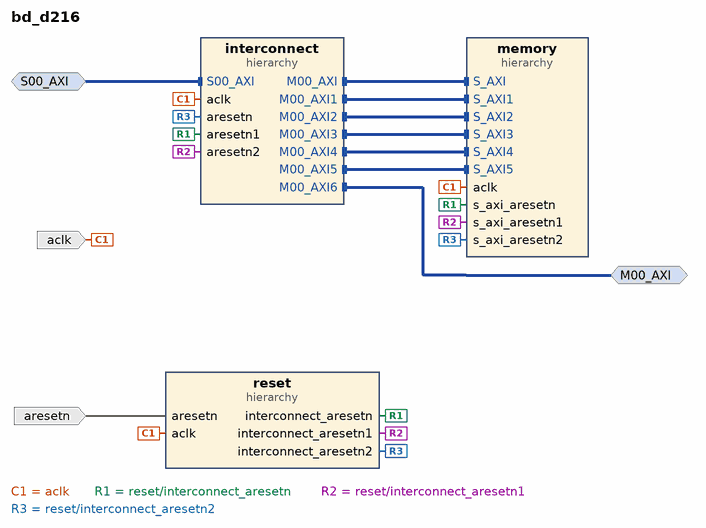
[diagram p0: block diagram of the top level]
# Vivado block design bd_d216, xcu55c-fsvh2892-2L-e, Vivado 2022.1
create_bd_design bd_d216

create_bd_intf_port -mode Slave -vlnv xilinx.com:interface:aximm_rtl:1.0 S00_AXI
set_property -dict [list \
  CONFIG.ADDR_WIDTH 38 \
  CONFIG.NUM_READ_OUTSTANDING 2 \
  CONFIG.NUM_WRITE_OUTSTANDING 2 \
  CONFIG.master_id 1 \
] [get_bd_intf_ports S00_AXI]
create_bd_intf_port -mode Master -vlnv xilinx.com:interface:aximm_rtl:1.0 M00_AXI
set_property -dict {CONFIG.ADDR_WIDTH 38} [get_bd_intf_ports M00_AXI]
create_bd_port -dir I -type clk aclk
set_property -dict {CONFIG.ASSOCIATED_BUSIF M00_AXI:S00_AXI} [get_bd_ports aclk]
create_bd_port -dir I -type rst aresetn

create_bd_cell -type hier reset
create_bd_cell -type hier interconnect
create_bd_cell -type hier memory

# ---- hierarchy /reset ----
current_bd_instance /reset
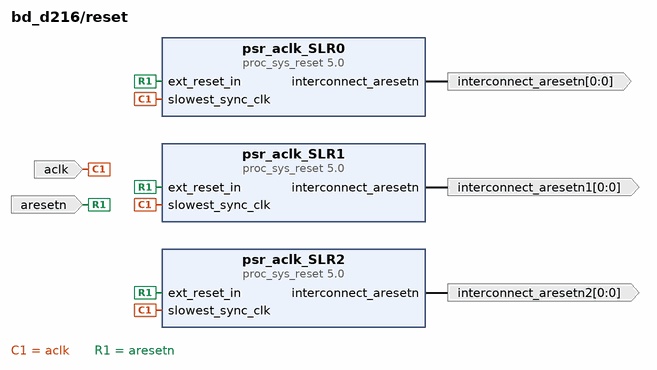
[diagram p1: block diagram inside /reset]
create_bd_pin -dir I -type clk aclk
create_bd_pin -dir I -type rst aresetn
create_bd_pin -dir O -from 0 -to 0 -type rst interconnect_aresetn
create_bd_pin -dir O -from 0 -to 0 -type rst interconnect_aresetn1
create_bd_pin -dir O -from 0 -to 0 -type rst interconnect_aresetn2

create_bd_cell -type ip -vlnv xilinx.com:ip:proc_sys_reset:5.0 psr_aclk_SLR0
set_property -dict {CONFIG.SLR_ASSIGNMENTS SLR0} [get_bd_cells psr_aclk_SLR0]
create_bd_cell -type ip -vlnv xilinx.com:ip:proc_sys_reset:5.0 psr_aclk_SLR1
set_property -dict {CONFIG.SLR_ASSIGNMENTS SLR1} [get_bd_cells psr_aclk_SLR1]
create_bd_cell -type ip -vlnv xilinx.com:ip:proc_sys_reset:5.0 psr_aclk_SLR2
set_property -dict {CONFIG.SLR_ASSIGNMENTS SLR2} [get_bd_cells psr_aclk_SLR2]

# ---- hierarchy /interconnect ----
current_bd_instance /interconnect
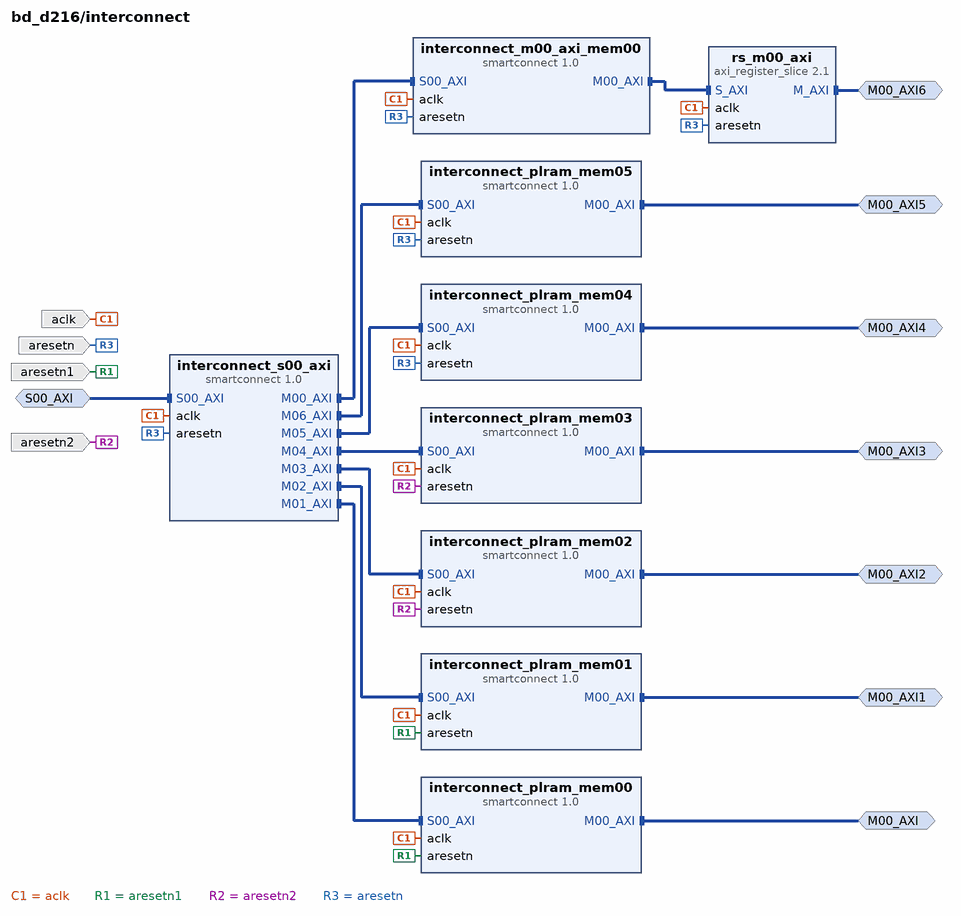
[diagram p2: block diagram inside /interconnect]
create_bd_intf_pin -mode Slave -vlnv xilinx.com:interface:aximm_rtl:1.0 S00_AXI
create_bd_intf_pin -mode Master -vlnv xilinx.com:interface:aximm_rtl:1.0 M00_AXI
create_bd_intf_pin -mode Master -vlnv xilinx.com:interface:aximm_rtl:1.0 M00_AXI1
create_bd_intf_pin -mode Master -vlnv xilinx.com:interface:aximm_rtl:1.0 M00_AXI2
create_bd_intf_pin -mode Master -vlnv xilinx.com:interface:aximm_rtl:1.0 M00_AXI3
create_bd_intf_pin -mode Master -vlnv xilinx.com:interface:aximm_rtl:1.0 M00_AXI4
create_bd_intf_pin -mode Master -vlnv xilinx.com:interface:aximm_rtl:1.0 M00_AXI5
create_bd_intf_pin -mode Master -vlnv xilinx.com:interface:aximm_rtl:1.0 M00_AXI6
create_bd_pin -dir I -type clk aclk
create_bd_pin -dir I -type rst aresetn
create_bd_pin -dir I -type rst aresetn1
create_bd_pin -dir I -type rst aresetn2

create_bd_cell -type ip -vlnv xilinx.com:ip:smartconnect:1.0 interconnect_s00_axi
set_property -dict [list \
  CONFIG.ADVANCED_PROPERTIES {__view__ {functional {S00_Buffer {R_SIZE 512 W_SIZE 512} S00_Entry {PKT_R_THR 512 LIM_R_LEN 256 PKT_W_THR 64 LIM_W_LEN 256}} timing {M01_Buffer {AR_SLR_PIPE 3 AW_SLR_PIPE 3 R_SLR_PIPE 3 W_SLR_PIPE 3 B_SLR_PIPE 3} M02_Buffer {AR_SLR_PIPE 3 AW_SLR_PIPE 3 R_SLR_PIPE 3 W_SLR_PIPE 3 B_SLR_PIPE 3} M03_Buffer {AR_SLR_PIPE 2 AW_SLR_PIPE 2 R_SLR_PIPE 2 W_SLR_PIPE 2 B_SLR_PIPE 2} M04_Buffer {AR_SLR_PIPE 2 AW_SLR_PIPE 2 R_SLR_PIPE 2 W_SLR_PIPE 2 B_SLR_PIPE 2}}}} \
  CONFIG.NUM_MI 7 \
  CONFIG.NUM_SI 1 \
] [get_bd_cells interconnect_s00_axi]
create_bd_cell -type ip -vlnv xilinx.com:ip:smartconnect:1.0 interconnect_m00_axi_mem00
set_property -dict {CONFIG.NUM_CLKS 1 CONFIG.NUM_SI 1} [get_bd_cells interconnect_m00_axi_mem00]
create_bd_cell -type ip -vlnv xilinx.com:ip:smartconnect:1.0 interconnect_plram_mem00
set_property -dict {CONFIG.NUM_CLKS 1 CONFIG.NUM_SI 1} [get_bd_cells interconnect_plram_mem00]
create_bd_cell -type ip -vlnv xilinx.com:ip:smartconnect:1.0 interconnect_plram_mem01
set_property -dict {CONFIG.NUM_CLKS 1 CONFIG.NUM_SI 1} [get_bd_cells interconnect_plram_mem01]
create_bd_cell -type ip -vlnv xilinx.com:ip:smartconnect:1.0 interconnect_plram_mem02
set_property -dict {CONFIG.NUM_CLKS 1 CONFIG.NUM_SI 1} [get_bd_cells interconnect_plram_mem02]
create_bd_cell -type ip -vlnv xilinx.com:ip:smartconnect:1.0 interconnect_plram_mem03
set_property -dict {CONFIG.NUM_CLKS 1 CONFIG.NUM_SI 1} [get_bd_cells interconnect_plram_mem03]
create_bd_cell -type ip -vlnv xilinx.com:ip:smartconnect:1.0 interconnect_plram_mem04
set_property -dict {CONFIG.NUM_CLKS 1 CONFIG.NUM_SI 1} [get_bd_cells interconnect_plram_mem04]
create_bd_cell -type ip -vlnv xilinx.com:ip:smartconnect:1.0 interconnect_plram_mem05
set_property -dict {CONFIG.NUM_CLKS 1 CONFIG.NUM_SI 1} [get_bd_cells interconnect_plram_mem05]
create_bd_cell -type ip -vlnv xilinx.com:ip:axi_register_slice:2.1 rs_m00_axi
set_property -dict [list \
  CONFIG.ADDR_WIDTH 38 \
  CONFIG.ARUSER_WIDTH 0 \
  CONFIG.AWUSER_WIDTH 0 \
  CONFIG.BUSER_WIDTH 0 \
  CONFIG.DATA_WIDTH 32 \
  CONFIG.HAS_BRESP 1 \
  CONFIG.HAS_BURST 1 \
  CONFIG.HAS_CACHE 1 \
  CONFIG.HAS_LOCK 1 \
  CONFIG.HAS_PROT 1 \
  CONFIG.HAS_QOS 1 \
  CONFIG.HAS_REGION 1 \
  CONFIG.HAS_RRESP 1 \
  CONFIG.HAS_WSTRB 1 \
  CONFIG.ID_WIDTH 0 \
  CONFIG.MAX_BURST_LENGTH 256 \
  CONFIG.NUM_READ_OUTSTANDING 1 \
  CONFIG.NUM_READ_THREADS 1 \
  CONFIG.NUM_WRITE_OUTSTANDING 1 \
  CONFIG.NUM_WRITE_THREADS 1 \
  CONFIG.PROTOCOL AXI4 \
  CONFIG.READ_WRITE_MODE READ_WRITE \
  CONFIG.REG_AR 0 \
  CONFIG.REG_AW 0 \
  CONFIG.REG_B 0 \
  CONFIG.REG_R 0 \
  CONFIG.REG_W 0 \
  CONFIG.RUSER_BITS_PER_BYTE 0 \
  CONFIG.RUSER_WIDTH 0 \
  CONFIG.SUPPORTS_NARROW_BURST 0 \
  CONFIG.WUSER_BITS_PER_BYTE 0 \
  CONFIG.WUSER_WIDTH 0 \
] [get_bd_cells rs_m00_axi]

# ---- hierarchy /memory ----
current_bd_instance /memory
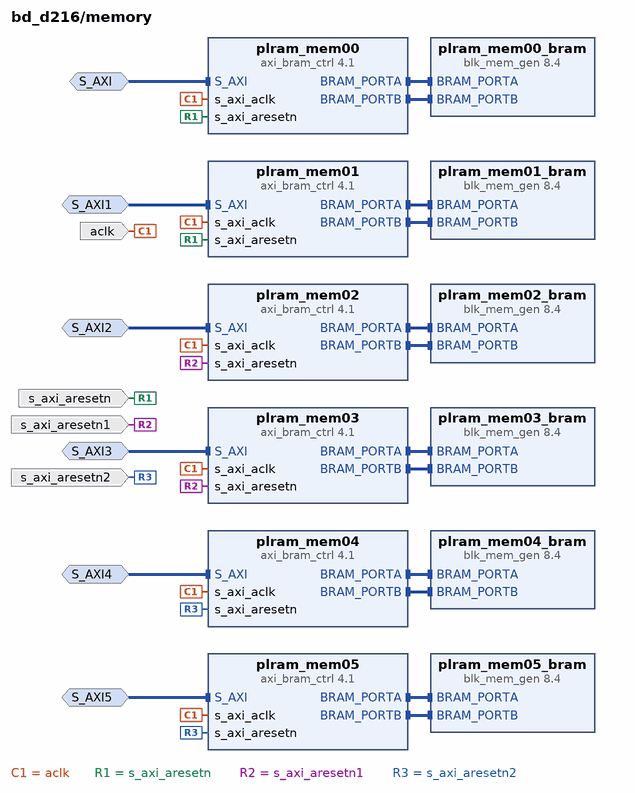
[diagram p3: block diagram inside /memory]
create_bd_intf_pin -mode Slave -vlnv xilinx.com:interface:aximm_rtl:1.0 S_AXI
create_bd_intf_pin -mode Slave -vlnv xilinx.com:interface:aximm_rtl:1.0 S_AXI1
create_bd_intf_pin -mode Slave -vlnv xilinx.com:interface:aximm_rtl:1.0 S_AXI2
create_bd_intf_pin -mode Slave -vlnv xilinx.com:interface:aximm_rtl:1.0 S_AXI3
create_bd_intf_pin -mode Slave -vlnv xilinx.com:interface:aximm_rtl:1.0 S_AXI4
create_bd_intf_pin -mode Slave -vlnv xilinx.com:interface:aximm_rtl:1.0 S_AXI5
create_bd_pin -dir I -type clk aclk
create_bd_pin -dir I -type rst s_axi_aresetn
create_bd_pin -dir I -type rst s_axi_aresetn1
create_bd_pin -dir I -type rst s_axi_aresetn2

create_bd_cell -type ip -vlnv xilinx.com:ip:axi_bram_ctrl:4.1 plram_mem00
set_property -dict {CONFIG.DATA_WIDTH 512 CONFIG.SLR_ASSIGNMENTS SLR0} [get_bd_cells plram_mem00]
create_bd_cell -type ip -vlnv xilinx.com:ip:blk_mem_gen:8.4 plram_mem00_bram
set_property -dict {CONFIG.Memory_Type True_Dual_Port_RAM CONFIG.SLR_ASSIGNMENTS SLR0} [get_bd_cells plram_mem00_bram]
create_bd_cell -type ip -vlnv xilinx.com:ip:axi_bram_ctrl:4.1 plram_mem01
set_property -dict {CONFIG.DATA_WIDTH 512 CONFIG.SLR_ASSIGNMENTS SLR0} [get_bd_cells plram_mem01]
create_bd_cell -type ip -vlnv xilinx.com:ip:blk_mem_gen:8.4 plram_mem01_bram
set_property -dict {CONFIG.Memory_Type True_Dual_Port_RAM CONFIG.SLR_ASSIGNMENTS SLR0} [get_bd_cells plram_mem01_bram]
create_bd_cell -type ip -vlnv xilinx.com:ip:axi_bram_ctrl:4.1 plram_mem02
set_property -dict {CONFIG.DATA_WIDTH 512 CONFIG.SLR_ASSIGNMENTS SLR1} [get_bd_cells plram_mem02]
create_bd_cell -type ip -vlnv xilinx.com:ip:blk_mem_gen:8.4 plram_mem02_bram
set_property -dict {CONFIG.Memory_Type True_Dual_Port_RAM CONFIG.SLR_ASSIGNMENTS SLR1} [get_bd_cells plram_mem02_bram]
create_bd_cell -type ip -vlnv xilinx.com:ip:axi_bram_ctrl:4.1 plram_mem03
set_property -dict {CONFIG.DATA_WIDTH 512 CONFIG.SLR_ASSIGNMENTS SLR1} [get_bd_cells plram_mem03]
create_bd_cell -type ip -vlnv xilinx.com:ip:blk_mem_gen:8.4 plram_mem03_bram
set_property -dict {CONFIG.Memory_Type True_Dual_Port_RAM CONFIG.SLR_ASSIGNMENTS SLR1} [get_bd_cells plram_mem03_bram]
create_bd_cell -type ip -vlnv xilinx.com:ip:axi_bram_ctrl:4.1 plram_mem04
set_property -dict {CONFIG.DATA_WIDTH 512 CONFIG.SLR_ASSIGNMENTS SLR2} [get_bd_cells plram_mem04]
create_bd_cell -type ip -vlnv xilinx.com:ip:blk_mem_gen:8.4 plram_mem04_bram
set_property -dict {CONFIG.Memory_Type True_Dual_Port_RAM CONFIG.SLR_ASSIGNMENTS SLR2} [get_bd_cells plram_mem04_bram]
create_bd_cell -type ip -vlnv xilinx.com:ip:axi_bram_ctrl:4.1 plram_mem05
set_property -dict {CONFIG.DATA_WIDTH 512 CONFIG.SLR_ASSIGNMENTS SLR2} [get_bd_cells plram_mem05]
create_bd_cell -type ip -vlnv xilinx.com:ip:blk_mem_gen:8.4 plram_mem05_bram
set_property -dict {CONFIG.Memory_Type True_Dual_Port_RAM CONFIG.SLR_ASSIGNMENTS SLR2} [get_bd_cells plram_mem05_bram]

# ---- connections ----

current_bd_instance /reset
connect_bd_net [get_bd_pins aclk] \
  [get_bd_pins psr_aclk_SLR1/slowest_sync_clk] [get_bd_pins psr_aclk_SLR2/slowest_sync_clk] \
  [get_bd_pins psr_aclk_SLR0/slowest_sync_clk]
connect_bd_net [get_bd_pins aresetn] \
  [get_bd_pins psr_aclk_SLR1/ext_reset_in] [get_bd_pins psr_aclk_SLR2/ext_reset_in] [get_bd_pins psr_aclk_SLR0/ext_reset_in]
connect_bd_net [get_bd_pins psr_aclk_SLR0/interconnect_aresetn] [get_bd_pins interconnect_aresetn]
connect_bd_net [get_bd_pins psr_aclk_SLR1/interconnect_aresetn] [get_bd_pins interconnect_aresetn1]
connect_bd_net [get_bd_pins psr_aclk_SLR2/interconnect_aresetn] [get_bd_pins interconnect_aresetn2]

current_bd_instance /interconnect
connect_bd_intf_net [get_bd_intf_pins S00_AXI] [get_bd_intf_pins interconnect_s00_axi/S00_AXI]
connect_bd_intf_net [get_bd_intf_pins interconnect_m00_axi_mem00/M00_AXI] [get_bd_intf_pins rs_m00_axi/S_AXI]
connect_bd_intf_net [get_bd_intf_pins M00_AXI] [get_bd_intf_pins interconnect_plram_mem00/M00_AXI]
connect_bd_intf_net [get_bd_intf_pins M00_AXI1] [get_bd_intf_pins interconnect_plram_mem01/M00_AXI]
connect_bd_intf_net [get_bd_intf_pins M00_AXI2] [get_bd_intf_pins interconnect_plram_mem02/M00_AXI]
connect_bd_intf_net [get_bd_intf_pins M00_AXI3] [get_bd_intf_pins interconnect_plram_mem03/M00_AXI]
connect_bd_intf_net [get_bd_intf_pins M00_AXI4] [get_bd_intf_pins interconnect_plram_mem04/M00_AXI]
connect_bd_intf_net [get_bd_intf_pins M00_AXI5] [get_bd_intf_pins interconnect_plram_mem05/M00_AXI]
connect_bd_intf_net [get_bd_intf_pins interconnect_s00_axi/M00_AXI] [get_bd_intf_pins interconnect_m00_axi_mem00/S00_AXI]
connect_bd_intf_net [get_bd_intf_pins interconnect_s00_axi/M01_AXI] [get_bd_intf_pins interconnect_plram_mem00/S00_AXI]
connect_bd_intf_net [get_bd_intf_pins interconnect_s00_axi/M02_AXI] [get_bd_intf_pins interconnect_plram_mem01/S00_AXI]
connect_bd_intf_net [get_bd_intf_pins interconnect_s00_axi/M03_AXI] [get_bd_intf_pins interconnect_plram_mem02/S00_AXI]
connect_bd_intf_net [get_bd_intf_pins interconnect_s00_axi/M04_AXI] [get_bd_intf_pins interconnect_plram_mem03/S00_AXI]
connect_bd_intf_net [get_bd_intf_pins interconnect_s00_axi/M05_AXI] [get_bd_intf_pins interconnect_plram_mem04/S00_AXI]
connect_bd_intf_net [get_bd_intf_pins interconnect_s00_axi/M06_AXI] [get_bd_intf_pins interconnect_plram_mem05/S00_AXI]
connect_bd_intf_net [get_bd_intf_pins M00_AXI6] [get_bd_intf_pins rs_m00_axi/M_AXI]
connect_bd_net [get_bd_pins aclk] \
  [get_bd_pins interconnect_plram_mem00/aclk] [get_bd_pins interconnect_plram_mem01/aclk] \
  [get_bd_pins interconnect_plram_mem02/aclk] [get_bd_pins interconnect_plram_mem03/aclk] \
  [get_bd_pins interconnect_plram_mem04/aclk] [get_bd_pins interconnect_plram_mem05/aclk] \
  [get_bd_pins interconnect_m00_axi_mem00/aclk] [get_bd_pins rs_m00_axi/aclk] [get_bd_pins interconnect_s00_axi/aclk]
connect_bd_net -net psr_aclk_SLR0_interconnect_aresetn [get_bd_pins aresetn1] \
  [get_bd_pins interconnect_plram_mem01/aresetn] [get_bd_pins interconnect_plram_mem00/aresetn]
connect_bd_net -net psr_aclk_SLR1_interconnect_aresetn [get_bd_pins aresetn2] \
  [get_bd_pins interconnect_plram_mem03/aresetn] [get_bd_pins interconnect_plram_mem02/aresetn]
connect_bd_net -net psr_aclk_SLR2_interconnect_aresetn [get_bd_pins aresetn] \
  [get_bd_pins interconnect_plram_mem04/aresetn] [get_bd_pins interconnect_plram_mem05/aresetn] \
  [get_bd_pins interconnect_m00_axi_mem00/aresetn] [get_bd_pins rs_m00_axi/aresetn] \
  [get_bd_pins interconnect_s00_axi/aresetn]

current_bd_instance /memory
connect_bd_intf_net -intf_net interconnect_PLRAM_MEM00_M00_AXI [get_bd_intf_pins S_AXI] [get_bd_intf_pins plram_mem00/S_AXI]
connect_bd_intf_net -intf_net interconnect_PLRAM_MEM01_M00_AXI [get_bd_intf_pins S_AXI1] [get_bd_intf_pins plram_mem01/S_AXI]
connect_bd_intf_net -intf_net interconnect_PLRAM_MEM02_M00_AXI [get_bd_intf_pins S_AXI2] [get_bd_intf_pins plram_mem02/S_AXI]
connect_bd_intf_net -intf_net interconnect_PLRAM_MEM03_M00_AXI [get_bd_intf_pins S_AXI3] [get_bd_intf_pins plram_mem03/S_AXI]
connect_bd_intf_net -intf_net interconnect_PLRAM_MEM04_M00_AXI [get_bd_intf_pins S_AXI4] [get_bd_intf_pins plram_mem04/S_AXI]
connect_bd_intf_net -intf_net interconnect_PLRAM_MEM05_M00_AXI [get_bd_intf_pins S_AXI5] [get_bd_intf_pins plram_mem05/S_AXI]
connect_bd_intf_net [get_bd_intf_pins plram_mem00_bram/BRAM_PORTA] [get_bd_intf_pins plram_mem00/BRAM_PORTA]
connect_bd_intf_net [get_bd_intf_pins plram_mem00_bram/BRAM_PORTB] [get_bd_intf_pins plram_mem00/BRAM_PORTB]
connect_bd_intf_net [get_bd_intf_pins plram_mem01_bram/BRAM_PORTA] [get_bd_intf_pins plram_mem01/BRAM_PORTA]
connect_bd_intf_net [get_bd_intf_pins plram_mem01_bram/BRAM_PORTB] [get_bd_intf_pins plram_mem01/BRAM_PORTB]
connect_bd_intf_net [get_bd_intf_pins plram_mem02_bram/BRAM_PORTA] [get_bd_intf_pins plram_mem02/BRAM_PORTA]
connect_bd_intf_net [get_bd_intf_pins plram_mem02_bram/BRAM_PORTB] [get_bd_intf_pins plram_mem02/BRAM_PORTB]
connect_bd_intf_net [get_bd_intf_pins plram_mem03_bram/BRAM_PORTA] [get_bd_intf_pins plram_mem03/BRAM_PORTA]
connect_bd_intf_net [get_bd_intf_pins plram_mem03_bram/BRAM_PORTB] [get_bd_intf_pins plram_mem03/BRAM_PORTB]
connect_bd_intf_net [get_bd_intf_pins plram_mem04_bram/BRAM_PORTA] [get_bd_intf_pins plram_mem04/BRAM_PORTA]
connect_bd_intf_net [get_bd_intf_pins plram_mem04_bram/BRAM_PORTB] [get_bd_intf_pins plram_mem04/BRAM_PORTB]
connect_bd_intf_net [get_bd_intf_pins plram_mem05_bram/BRAM_PORTA] [get_bd_intf_pins plram_mem05/BRAM_PORTA]
connect_bd_intf_net [get_bd_intf_pins plram_mem05_bram/BRAM_PORTB] [get_bd_intf_pins plram_mem05/BRAM_PORTB]
connect_bd_net [get_bd_pins aclk] \
  [get_bd_pins plram_mem01/s_axi_aclk] [get_bd_pins plram_mem02/s_axi_aclk] [get_bd_pins plram_mem03/s_axi_aclk] \
  [get_bd_pins plram_mem04/s_axi_aclk] [get_bd_pins plram_mem05/s_axi_aclk] [get_bd_pins plram_mem00/s_axi_aclk]
connect_bd_net -net psr_aclk_SLR0_interconnect_aresetn [get_bd_pins s_axi_aresetn] \
  [get_bd_pins plram_mem01/s_axi_aresetn] [get_bd_pins plram_mem00/s_axi_aresetn]
connect_bd_net -net psr_aclk_SLR1_interconnect_aresetn [get_bd_pins s_axi_aresetn1] \
  [get_bd_pins plram_mem03/s_axi_aresetn] [get_bd_pins plram_mem02/s_axi_aresetn]
connect_bd_net -net psr_aclk_SLR2_interconnect_aresetn [get_bd_pins s_axi_aresetn2] \
  [get_bd_pins plram_mem05/s_axi_aresetn] [get_bd_pins plram_mem04/s_axi_aresetn]

current_bd_instance /
connect_bd_intf_net [get_bd_intf_ports S00_AXI] [get_bd_intf_pins interconnect/S00_AXI]
connect_bd_intf_net -intf_net interconnect_PLRAM_MEM00_M00_AXI [get_bd_intf_pins interconnect/M00_AXI] [get_bd_intf_pins memory/S_AXI]
connect_bd_intf_net -intf_net interconnect_PLRAM_MEM01_M00_AXI [get_bd_intf_pins interconnect/M00_AXI1] [get_bd_intf_pins memory/S_AXI1]
connect_bd_intf_net -intf_net interconnect_PLRAM_MEM02_M00_AXI [get_bd_intf_pins interconnect/M00_AXI2] [get_bd_intf_pins memory/S_AXI2]
connect_bd_intf_net -intf_net interconnect_PLRAM_MEM03_M00_AXI [get_bd_intf_pins interconnect/M00_AXI3] [get_bd_intf_pins memory/S_AXI3]
connect_bd_intf_net -intf_net interconnect_PLRAM_MEM04_M00_AXI [get_bd_intf_pins interconnect/M00_AXI4] [get_bd_intf_pins memory/S_AXI4]
connect_bd_intf_net -intf_net interconnect_PLRAM_MEM05_M00_AXI [get_bd_intf_pins interconnect/M00_AXI5] [get_bd_intf_pins memory/S_AXI5]
connect_bd_intf_net -intf_net rs_M00_AXI_M_AXI [get_bd_intf_ports M00_AXI] [get_bd_intf_pins interconnect/M00_AXI6]
connect_bd_net [get_bd_ports aclk] [get_bd_pins reset/aclk] [get_bd_pins interconnect/aclk] [get_bd_pins memory/aclk]
connect_bd_net [get_bd_ports aresetn] [get_bd_pins reset/aresetn]
connect_bd_net -net psr_aclk_SLR0_interconnect_aresetn [get_bd_pins reset/interconnect_aresetn] \
  [get_bd_pins interconnect/aresetn1] [get_bd_pins memory/s_axi_aresetn]
connect_bd_net -net psr_aclk_SLR1_interconnect_aresetn [get_bd_pins reset/interconnect_aresetn1] \
  [get_bd_pins interconnect/aresetn2] [get_bd_pins memory/s_axi_aresetn1]
connect_bd_net -net psr_aclk_SLR2_interconnect_aresetn [get_bd_pins reset/interconnect_aresetn2] \
  [get_bd_pins interconnect/aresetn] [get_bd_pins memory/s_axi_aresetn2]

# ---- address map ----
assign_bd_address -offset 0x0400000000 -range 128K -target_address_space [get_bd_addr_spaces S00_AXI] [get_bd_addr_segs memory/plram_mem00/S_AXI/Mem0]
assign_bd_address -offset 0x0400400000 -range 128K -target_address_space [get_bd_addr_spaces S00_AXI] [get_bd_addr_segs memory/plram_mem01/S_AXI/Mem0]
assign_bd_address -offset 0x0401000000 -range 128K -target_address_space [get_bd_addr_spaces S00_AXI] [get_bd_addr_segs memory/plram_mem02/S_AXI/Mem0]
assign_bd_address -offset 0x0401400000 -range 128K -target_address_space [get_bd_addr_spaces S00_AXI] [get_bd_addr_segs memory/plram_mem03/S_AXI/Mem0]
assign_bd_address -offset 0x0402000000 -range 128K -target_address_space [get_bd_addr_spaces S00_AXI] [get_bd_addr_segs memory/plram_mem04/S_AXI/Mem0]
assign_bd_address -offset 0x0402400000 -range 128K -target_address_space [get_bd_addr_spaces S00_AXI] [get_bd_addr_segs memory/plram_mem05/S_AXI/Mem0]
assign_bd_address -offset 0x2000000000 -range 16G -target_address_space [get_bd_addr_spaces S00_AXI] [get_bd_addr_segs M00_AXI/Reg]

validate_bd_design
save_bd_design
